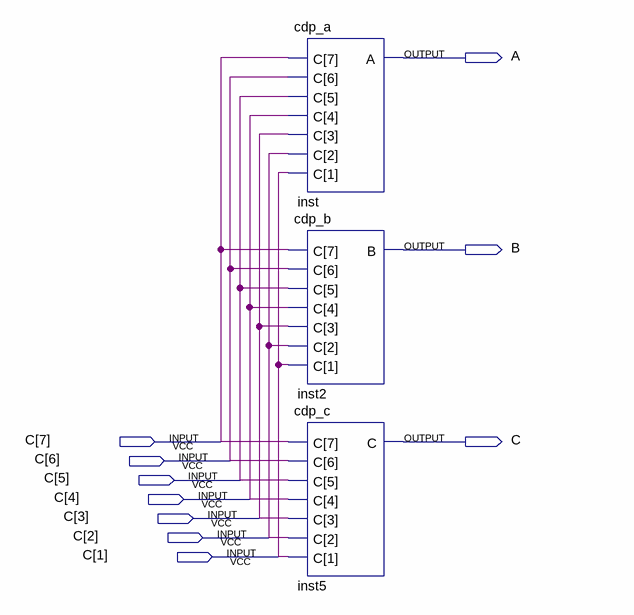
[diagram p0: schematic sheet]
// Quartus schematic cdp.bdf as structural Verilog: 3 symbols, 10 pins
module cdp (
  input  [7:1] C,
  output A,
  output B,
  output C_1bit
);

  cdp_a inst (.C(C), .A(A));
  cdp_b inst2 (.C(C), .B(B));
  cdp_c inst5 (.C({C, C_1bit}));
endmodule
